# Altium schematic sheet MC_Project.SchDoc
size B; SheetNumber: 1; SheetTotal: 1
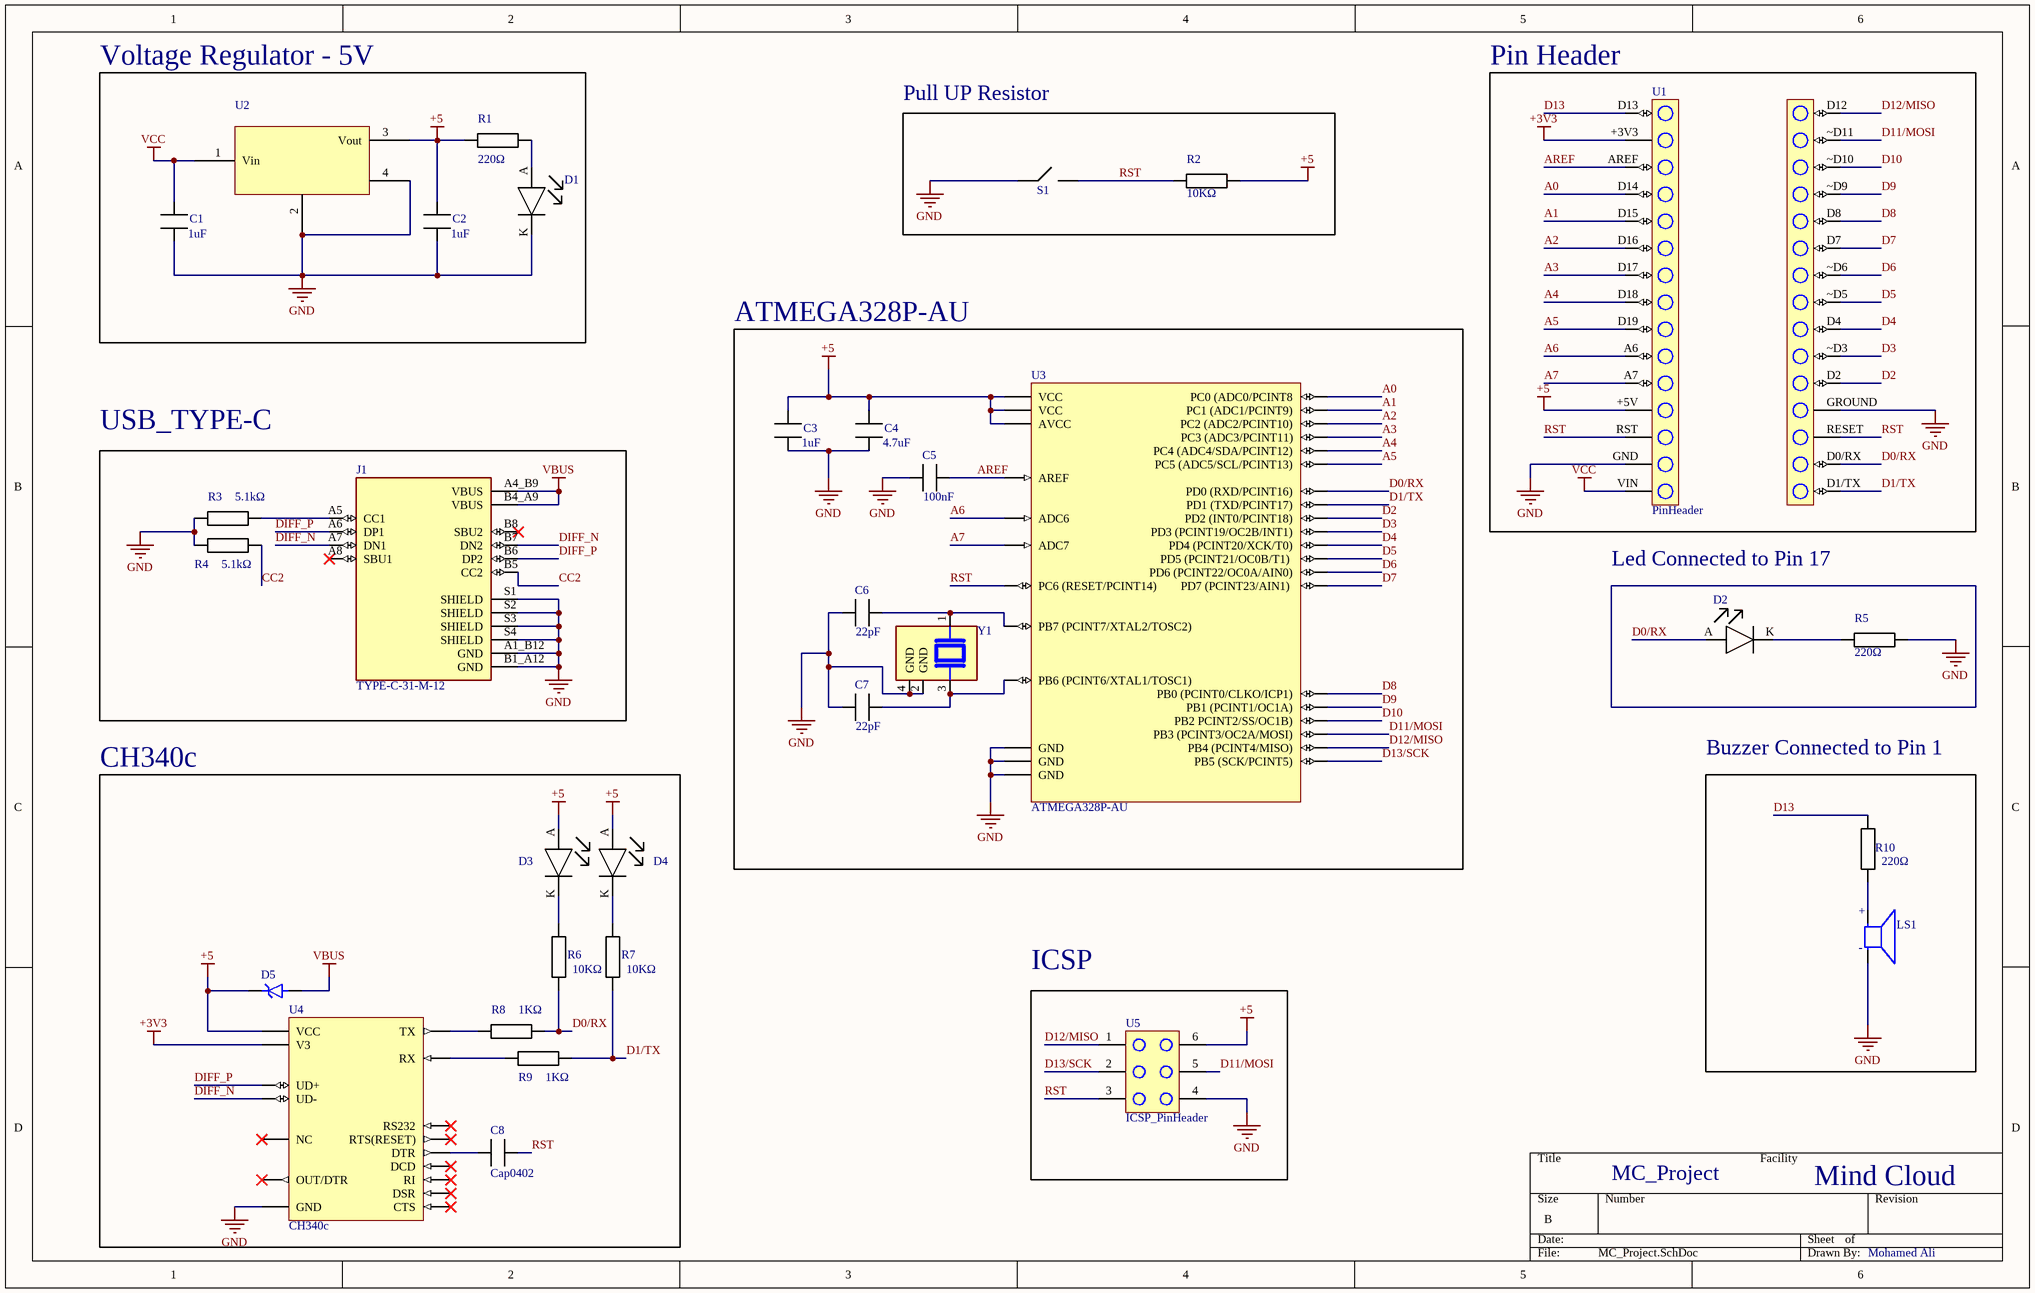
[diagram p0: MC_Project.SchDoc]

## Parts
C1  value 1uF  [CAPC1005X06N]  (hidden comment: Cap0402)
C2  value 1uF  [CAPC1005X06N]  (hidden comment: Cap0402)
C3  value 1uF  [CAPC1005X06N]  (hidden comment: Cap0402)
C4  value 4.7uF  [CAPC1005X06N]  (hidden comment: Cap0402)
C5  value 100nF  [CAPC1005X06N]  (hidden comment: Cap0402)
C6  value 22pF  [CAPC1005X06N]  (hidden comment: Cap0402)
C7  value 22pF  [CAPC1005X06N]  (hidden comment: Cap0402)
C8  Cap0402  [CAPC1005X06N]
D1  LED0805  [Led]  (value not drawn)
D2  LED0805  [Led]  (value not drawn)
D3  LED0805  [Led]  (value not drawn)
D4  LED0805  [Led]  (value not drawn)
D5  1SMA5926  [DIOM4325X250N]  (value not drawn)
J1  TYPE-C-31-M-12  [HRO_TYPE-C-31-M-12]
LS1  CMI-9705-0380-SMT-TR  [CUI_CMI-9705-0380-SMT-TR]  (value not drawn)
R1  value 220Ω  [RESC1508X03N]  (hidden comment: Resistance-0603)
R2  value 10KΩ  [RESC1508X03N]  (hidden comment: Resistance-0603)
R3  value 5.1kΩ  [RESC1508X03N]  (hidden comment: Resistance-0603)
R4  value 5.1kΩ  [RESC1508X03N]  (hidden comment: Resistance-0603)
R5  value 220Ω  [RESC1508X03N]  (hidden comment: Resistance-0603)
R6  value 10KΩ  [RESC1508X03N]  (hidden comment: Resistance-0603)
R7  value 10KΩ  [RESC1508X03N]  (hidden comment: Resistance-0603)
R8  value 1KΩ  [RESC1508X03N]  (hidden comment: Resistance-0603)
R9  value 1KΩ  [RESC1508X03N]  (hidden comment: Resistance-0603)
R10  value 220Ω  [RESC1508X03N]  (hidden comment: Resistance-0603)
S1  Switch  [Switch - duplicate]  (value not drawn)
U1  PinHeader  [PCBComponent_1]
U2  LM7805  [LM7805-SOT223]  (value not drawn)
U3  ATMEGA328P-AU  [ATMEGA328P-AU]
U4  CH340c  [CH340c]
U5  ICSP_PinHeader  [Edge Connector]
Y1  ABM3B-16.000MHZ-B2-T  [XTAL_ABM3B-16.000MHZ-B2-T]  (value not drawn)

## Blocks framed on the sheet
Voltage Regulator - 5V: C1 C2 D1 R1 U2
Pull UP Resistor: R2 S1
Pin Header: U1
ATMEGA328P-AU: C3-C7 U3 Y1
USB_TYPE-C: J1 R3 R4
CH340c: C8 D3-D5 R6-R9 U4
Buzzer Connected to Pin 1: LS1 R10
ICSP: U5

## Nets
+3V3: U1.+3V3 U4.4(V3)
+5: C2.2 C3.2 C4.2 D3.A D4.A D5.C(K) R1.1 R2.2 U1.+5V U2.3(Vout) U3.4(VCC) U3.6(VCC) U3.18(AVCC) U4.16(VCC) U5.6
GND: C1.1 C2.1 C3.1 C4.1 C5.1 C6.1 C7.1 D1.K J1.A1_B12(GND) J1.B1_A12(GND) J1.S1(SHIELD) J1.S2(SHIELD) J1.S3(SHIELD) J1.S4(SHIELD) LS1.N R3.1 R4.1 R5.2 S1.1 U1.GND U1.GROUND U2.2(Common) U2.4(Common) U3.3(GND) U3.5(GND) U3.21(GND) U4.1(GND) U5.4 Y1.2(GND) Y1.4(GND)
VBUS: D5.A J1.A4_B9(VBUS) J1.B4_A9(VBUS)
VCC: C1.2 U1.VIN U2.1(Vin)
A0: U1.D14 U3.23(PC0_(ADC0/PCINT8)
A1: U1.D15 U3.24(PC1_(ADC1/PCINT9))
A2: U1.D16 U3.25(PC2_(ADC2/PCINT10))
A3: U1.D17 U3.26(PC3_(ADC3/PCINT11))
A4: U1.D18 U3.27(PC4_(ADC4/SDA/PCINT12))
A5: U1.D19 U3.28(PC5_(ADC5/SCL/PCINT13))
A6: U1.A6 U3.19(ADC6)
A7: U1.A7 U3.22(ADC7)
AREF: C5.2 U1.AREF U3.20(AREF)
CC2: J1.B5(CC2) R4.2
D0/RX: D2.A R6.1 R8.2 U1.D0/RX U3.30(PD0_(RXD/PCINT16))
D1/TX: R7.1 R9.2 U1.D1/TX U3.31(PD1_(TXD/PCINT17))
D2: U1.D2 U3.32(PD2_(INT0/PCINT18))
D3: U1.~D3 U3.1(PD3_(PCINT19/OC2B/INT1))
D4: U1.D4 U3.2(PD4_(PCINT20/XCK/T0))
D5: U1.~D5 U3.9(PD5_(PCINT21/OC0B/T1))
D6: U1.~D6 U3.10(PD6_(PCINT22/OC0A/AIN0))
D7: U1.D7 U3.11(PD7_(PCINT23/AIN1))
D8: U1.D8 U3.12(PB0_(PCINT0/CLKO/ICP1))
D9: U1.~D9 U3.13(PB1_(PCINT1/OC1A))
D10: U1.~D10 U3.14(PB2_PCINT2/SS/OC1B))
D11/MOSI: U1.~D11 U3.15(PB3_(PCINT3/OC2A/MOSI)) U5.5
D12/MISO: U1.D12 U3.16(PB4_(PCINT4/MISO)) U5.1
D13: R10.2 U1.D13
D13/SCK: U3.17(PB5_(SCK/PCINT5)) U5.2
DIFF_N: J1.A7(DN1) J1.B7(DN2) U4.6(UD-)
DIFF_P: J1.A6(DP1) J1.B6(DP2) U4.5(UD+)
RST: C8.2 R2.1 S1.2 U1.RESET U1.RST U3.29(PC6_(RESET/PCINT14)) U5.3
NetC6_2: C6.2 U3.8(PB7_(PCINT7/XTAL2/TOSC2)) Y1.1
NetC7_2: C7.2 U3.7(PB6_(PCINT6/XTAL1/TOSC1)) Y1.3
NetC8_1: C8.1 U4.13(DTR)
NetD1_A: D1.A R1.2
NetD2_K: D2.K R5.1
NetD3_K: D3.K R6.2
NetD4_K: D4.K R7.2
NetJ1_A5: J1.A5(CC1) R3.2
NetLS1_P: LS1.P R10.1
NetR8_1: R8.1 U4.2(TX)
NetR9_1: R9.1 U4.3(RX)

Not connected (* = marked no-connect by the designer): J1 A8(SBU1)* B8(SBU2)*; U4 7(NC)* 8(OUT/DTR)* 9(CTS)* 10(DSR)* 11(RI)* 12(DCD)* 14(RTS(RESET))* 15(RS232)*

## Notes on the sheet
- Led Connected to Pin 17
- MC_Project
- Facility
- Mind Cloud
- Mohamed Ali
- (in symbol CMI-9705-0380-SMT-TR) +; -

## Library data of the parts
C1-C8 = Cap0402: Manufacturer: Murata Electronics; Manufacturer Part Number: GRM155R71C104KA88J; Supplier: DigiKey; Supplier Part Number: 490-6328-2-ND
D1-D4 = LED0805: Manufacturer: Würth Elektronik; Manufacturer Part Number: 150080BS75000; Supplier: DigiKey; Supplier Part Number: 732-4982-2-ND
D5 = 1SMA5926: DO-214AC (SMA), 1500mW, 5%, Zener Diode; MF: Taiwan Semiconductor; Package: SMA-2 Taiwan Semiconductor; Availability: In Stock; Purchase-URL: https://pricing.snapeda.com/search/part/1SMA5926/?ref=eda; SnapEDA_Link: https://www.snapeda.com/parts/1SMA5926/Taiwan+Semiconductor/view-part/?ref=snap; MP: 1SMA5926; Price: None; Check_prices: https://www.snapeda.com/parts/1SMA5926/Taiwan+Semiconductor/view-part/?ref=eda; Value: *
J1 = TYPE-C-31-M-12: USB Connectors 24 Receptacle 1 8.94*7.3mm RoHS; MF: HRO Electronics Co., Ltd.; Price: None; Value: *; SnapEDA_Link: https://www.snapeda.com/parts/TYPE-C-31-M-12/HRO+Electronics+Co.%252C+Ltd./view-part/?ref=snap; Package: Package; Availability: Not in stock; Check_prices: https://www.snapeda.com/parts/TYPE-C-31-M-12/HRO+Electronics+Co.%252C+Ltd./view-part/?ref=eda; MP: TYPE-C-31-M-12
LS1 = CMI-9705-0380-SMT-TR: 9.7 mm, 3 Vdc, 80 dB, Surface Mount, Driving Circuit, Magnetic Audio Indicator Buzzer; MF: CUI Devices; Purchase-URL: https://pricing.snapeda.com/search/part/CMI-9705-0380-SMT-TR/?ref=eda; CUI_purchase_URL: https://www.cuidevices.com/product/audio/buzzers/audio-indicators/cmi-9705-0380-smt-tr?utm_source=snapeda.com&utm_medium=referral&utm_campaign=snapedaBOM; MP: CMI-9705-0380-SMT-TR; Package: CUI Inc.; SnapEDA_Link: https://www.snapeda.com/parts/CMI-9705-0380-SMT-TR/CUI+Devices/view-part/?ref=snap; Value: *; Check_prices: https://www.snapeda.com/parts/CMI-9705-0380-SMT-TR/CUI+Devices/view-part/?ref=eda; Digi-Key_Part_Number: 102-CMI-9705-0380-SMT-TR-ND
R1-R10 = Resistance-0603: Manufacturer: YAGEO; Manufacturer Part Number: RC0603FR-0710KL; Supplier: DigiKey; Supplier Part Number: 311-10.0KHRTR-ND
S1 = Switch: Manufacturer: Alps Alpine; Manufacturer Part Number: SKRPACE010; Suplier Part  Number: 4809-SKRPACE010TR-ND; Suplier: DigiKey
U2 = LM7805: 5V, 1.5A linear voltage regulator with thermal and short-circuit protection. Requires 7V-35V input, typical dropout voltage of 2V.; Manufacturer: Texas Instruments; Manufacturer Part Number: LM7805/NOPB; Supplier: Digikey; Supplier Part Number: LM7805MP/NOPB-ND
U3 = ATMEGA328P-AU: 8-bit microcontroller with 32KB Flash, 2KB SRAM, and 23 I/O pins, operating at up to 20MHz in a TQFP-32 package. Ideal for embedded applications.; Manufacturer: Microchip Technology; Manufacturer Part Number: ATMEGA328P-AU; Supplier: Digikey; Supplier Part Number: ATMEGA328P-AU-ND; ComponentLink1Description: Data Sheet; ComponentLink1URL: https://ww1.microchip.com/downloads/aemDocuments/documents/MCU08/ProductDocuments/DataSheets/Atmel-7810-Automotive-Microcontrollers-ATmega328P_Datasheet.pdf; Family: TQFP
U4 = CH340c: USB-to-serial converter IC with built-in crystal oscillator and power-on reset, simplifying UART, I2C, or SPI communication. Ideal for compact designs requiring USB connectivity.; Manufacturer: WCH(Jiangsu Qin Heng); Manufacturer Part Number: CH340C-SSOP16; Supplier: Digi-Key; Supplier Part Number: CH340C-ND; Family: SOP-16
U5 = ICSP_PinHeader: Manufacturer: TE Connectivity AMP Connectors; Manufacturer Part Number: 4-103321-0; Supplier: DigiKey; Supplier Part Number: A26520-ND
Y1 = ABM3B-16.000MHZ-B2-T: 16 MHz Â±20ppm Crystal 18pF 50 Ohms 4-SMD, No Lead; MF: Abracon; MP: ABM3B-16.000MHZ-B2-T; Package: SMD-4 Abracon LLC; Availability: In Stock; Price: None; Purchase-URL: https://pricing.snapeda.com/search/part/ABM3B-16.000MHZ-B2-T/?ref=eda; SnapEDA_Link: https://www.snapeda.com/parts/ABM3B-16.000MHZ-B2-T/Abracon+LLC/view-part/?ref=snap; Check_prices: https://www.snapeda.com/parts/ABM3B-16.000MHZ-B2-T/Abracon+LLC/view-part/?ref=eda; Value: *